# EAGLE design tri to ramp-pls 2-25-23 (EAGLE 9.6.2)
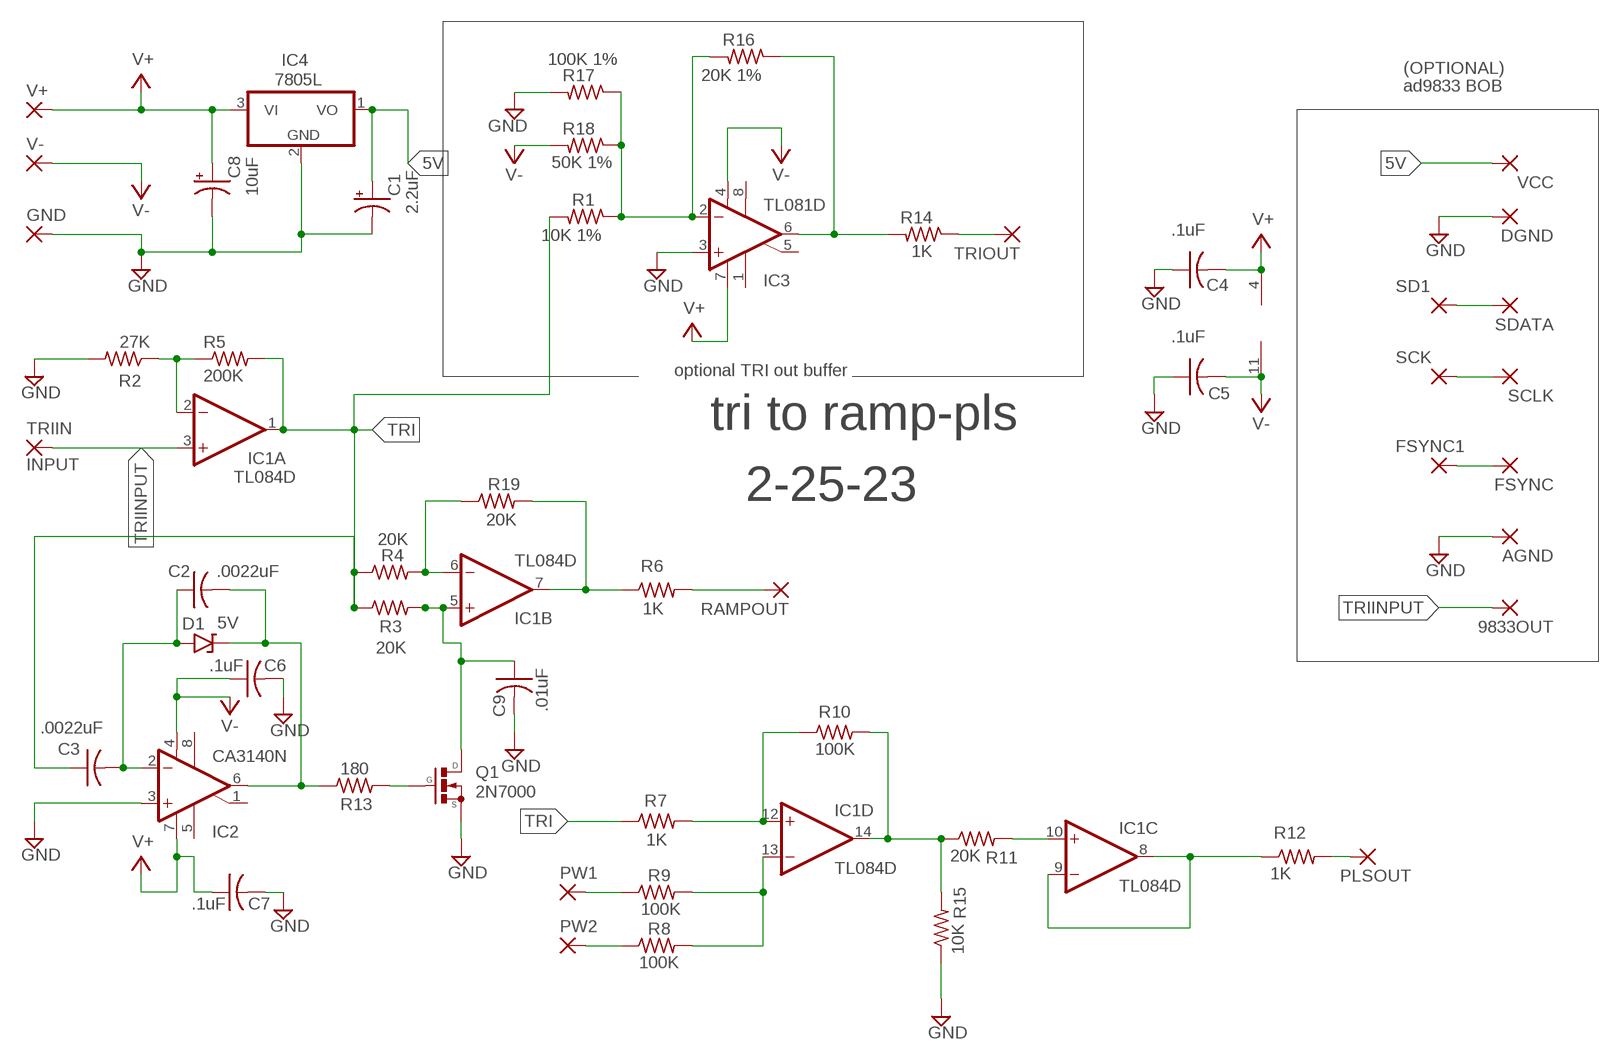
[diagram p0: schematic, sheet 1]

## Parts
9833OUT  WIREPAD1,6/0,8  [1,6/0,8]
AGND  WIREPAD1,6/0,8  [1,6/0,8]
C1  2.2uF  CPOL-USE5-4  [E5-4]
C2  .0022uF  C-US050-030X075  [C050-030X075]
C3  .0022uF  C-US050-035X075  [C050-035X075]
C4  .1uF  C-US025-025X050  [C025-025X050]
C5  .1uF  C-US025-025X050  [C025-025X050]
C6  .1uF  C-US025-025X050  [C025-025X050]
C7  .1uF  C-US025-025X050  [C025-025X050]
C8  10uF  CPOL-USE5-4  [E5-4]
C9  .01uF  C-US050-035X075  [C050-035X075]
D1  5V  ZENER.3  [DO41-3]
DGND  WIREPAD1,6/0,8  [1,6/0,8]
FSYNC  WIREPAD1,6/0,8  [1,6/0,8]
FSYNC1  WIREPAD1,6/0,8  [1,6/0,8]
GND  WIREPAD1,6/0,8  [1,6/0,8]
IC1  TL084D  [SO14]
IC2  CA3140N  [DIL08]
IC3  TL081D  [SO08]
IC4  7805L  ADAFRUIT_7805L  [ADAFRUIT_TO92]
PLSOUT  WIREPAD1,6/0,8  [1,6/0,8]
PW1  WIREPAD1,6/0,8  [1,6/0,8]
PW2  WIREPAD1,6/0,8  [1,6/0,8]
Q1  2N7000  [TO92-]
R1  10K 1%  R-US_0204/7  [0204/7]
R2  27K  R-US_0204/7  [0204/7]
R3  20K  R-US_0204/7  [0204/7]
R4  20K  R-US_0204/7  [0204/7]
R5  200K  R-US_0204/7  [0204/7]
R6  1K  R-US_0204/7  [0204/7]
R7  1K  R-US_0204/7  [0204/7]
R8  100K  R-US_0204/7  [0204/7]
R9  100K  R-US_0204/7  [0204/7]
R10  100K  R-US_0204/7  [0204/7]
R11  20K  R-US_0204/7  [0204/7]
R12  1K  R-US_0204/7  [0204/7]
R13  180  R-US_0204/7  [0204/7]
R14  1K  R-US_0204/7  [0204/7]
R15  10K  R-US_0204/7  [0204/7]
R16  20K 1%  R-US_0204/7  [0204/7]
R17  100K 1%  R-US_0204/7  [0204/7]
R18  50K 1%  R-US_0204/7  [0204/7]
R19  20K  R-US_0204/7  [0204/7]
RAMPOUT  WIREPAD1,6/0,8  [1,6/0,8]
SCK  WIREPAD1,6/0,8  [1,6/0,8]
SCLK  WIREPAD1,6/0,8  [1,6/0,8]
SD1  WIREPAD1,6/0,8  [1,6/0,8]
SDATA  WIREPAD1,6/0,8  [1,6/0,8]
TRIIN  INPUT  WIREPAD1,6/0,8  [1,6/0,8]
TRIOUT  WIREPAD1,6/0,8  [1,6/0,8]
V+  WIREPAD1,6/0,8  [1,6/0,8]
V-  WIREPAD1,6/0,8  [1,6/0,8]
VCC  WIREPAD1,6/0,8  [1,6/0,8]

## Nets
5V: C1.+ IC4.1(VO) VCC.1(P)
GND: AGND.1(P) C1.- C4.1 C5.1 C6.2 C7.2 C8.- C9.2 DGND.1(P) GND.1(P) IC2.3(+IN) IC3.3(+IN) IC4.2(GND) Q1.3(S) R2.2 R15.1 R17.2
N$1: IC1.2(A:-IN) R2.1 R5.1
N$2: PW1.1(P) R9.1
N$3: SD1.1(P) SDATA.1(P)
N$4: IC1.12(D:+IN) R7.2 R10.1
N$5: IC1.6(B:-IN) R4.2 R19.1
N$6: C9.1 IC1.5(B:+IN) Q1.1(D) R3.2
N$7: C2.1 C3.2 D1.A IC2.2(-IN)
N$8: IC1.7(B:OUT) R6.1 R19.2
N$9: C2.2 D1.C IC2.6(OUT) R13.1
N$10: Q1.2(G) R13.2
N$11: IC1.14(D:OUT) R10.2 R11.1 R15.2
N$12: R6.2 RAMPOUT.1(P)
N$13: IC1.10(C:+IN) R11.2
N$14: IC1.8(C:OUT) IC1.9(C:-IN) R12.1
N$15: PLSOUT.1(P) R12.2
N$16: IC1.13(D:-IN) R8.2 R9.2
N$17: IC3.2(-IN) R1.1 R16.2 R17.1 R18.1
N$18: PW2.1(P) R8.1
N$19: R14.1 TRIOUT.1(P)
N$20: SCK.1(P) SCLK.1(P)
N$21: FSYNC1.1(P) FSYNC.1(P)
N$22: IC3.6(OUT) R14.2 R16.1
TRI: C3.1 IC1.1(A:OUT) R1.2 R3.1 R4.1 R5.2 R7.1
TRIINPUT: 9833OUT.1(P) IC1.3(A:+IN) TRIIN.1(P)
V+: C4.2 C7.1 C8.+ IC1.4(P:V+) IC2.7(V+) IC3.7(V+) IC4.3(VI) V+.1(P)
V-: C5.2 C6.1 IC1.11(P:V-) IC2.4(V-) IC3.4(V-) R18.2 V-.1(P)
Unconnected: IC2.1(ON/CMP) IC2.5(ON) IC2.8(CMP) IC3.1(ON1) IC3.5(ON2) IC3.8(OPT)

## Notes on the sheet
- (OPTIONAL)
- ad9833 BOB
- optional TRI out buffer
- tri to ramp-pls
- 2-25-23

## Library data of the parts
9833OUT AGND DGND FSYNC FSYNC1 GND PLSOUT PW1 PW2 RAMPOUT SCK SCLK SD1 SDATA TRIIN TRIOUT V+ V- VCC = wirepad:WIREPAD: Wire PAD connect wire on PCB
C1 C8 = adafruit:CPOL-US: POLARIZED CAPACITOR, American symbol
C2-C7 C9 = rcl:C-US: CAPACITOR, American symbol; SPICEPREFIX: C
D1 = diodes:ZENER
IC1 = linear:TL084: OP AMP
IC2 = linear:CA3140: OP AMP
IC3 = linear:TL081: OP AMP
IC4 = avr328 11-4-21:ADAFRUIT_78*: Positive VOLTAGE REGULATOR Added bigger pads to the TO-92 package
Q1 = transistors:2N7000
R1-R19 = rcl:R-US_: RESISTOR, American symbol

## Board
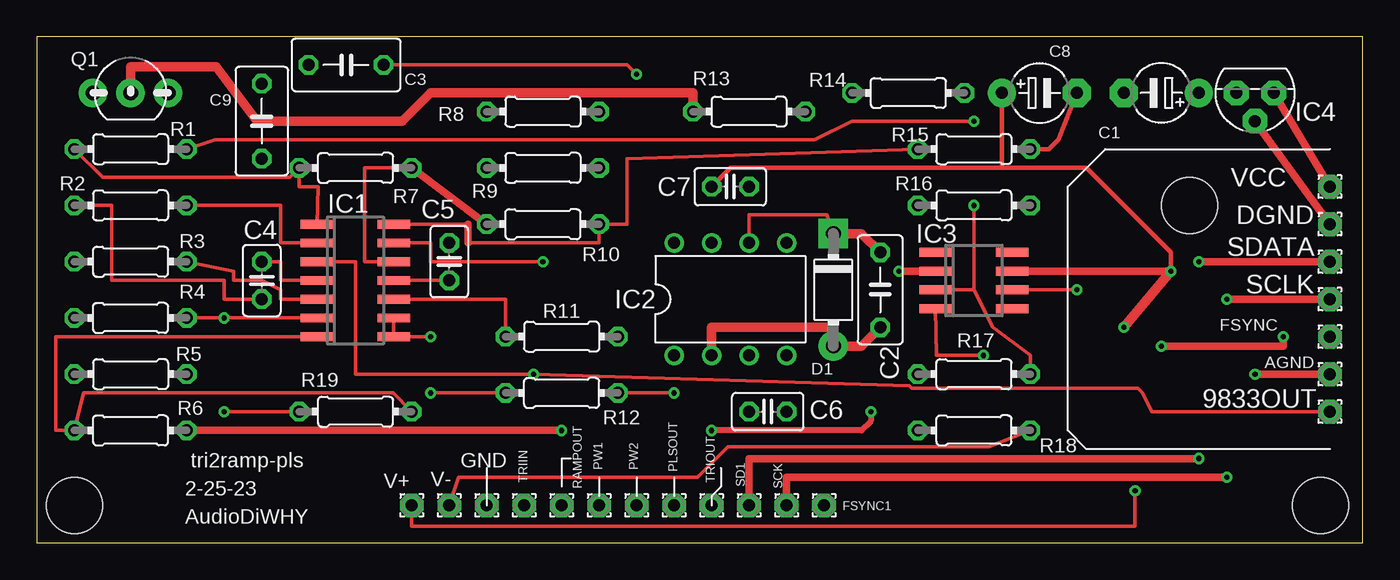
[diagram p1: board, top side]
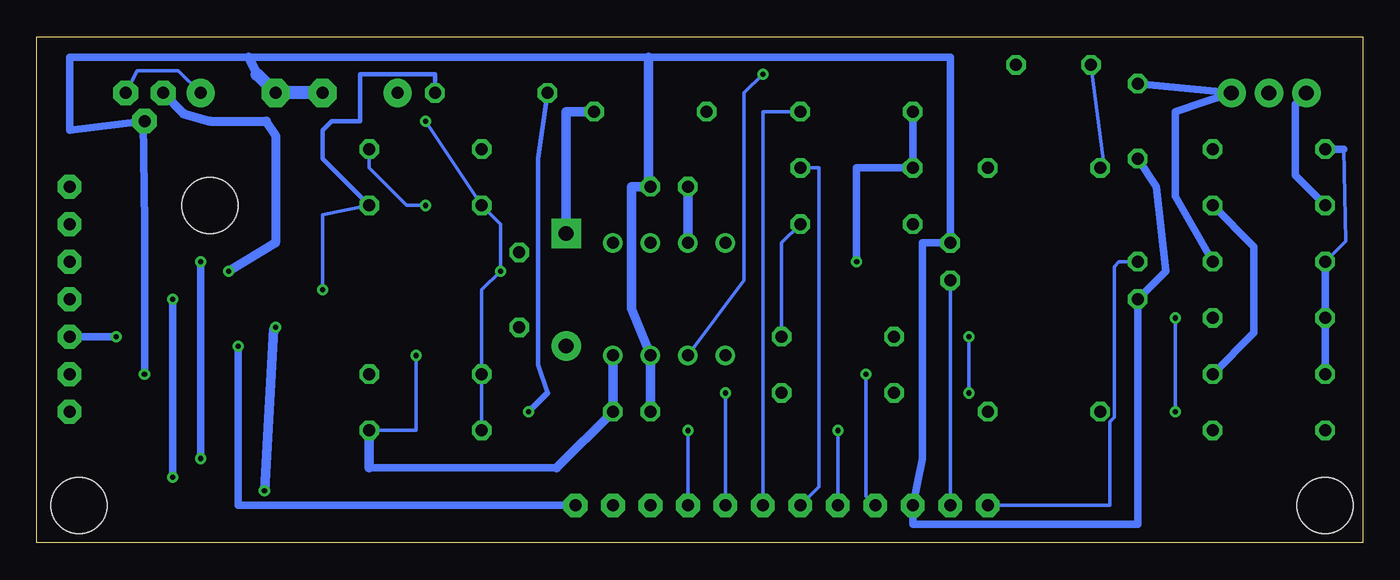
[diagram p2: board, bottom side, seen from below]

Size 89.84 x 34.28 mm. Coordinates in mm from the lower left corner, seen from the top.
Outline: 0,0 89.84,0 89.84,34.28 0,34.28 0,0
Copper layers (1*16): Top 0.035mm / dielectric 1.5mm / Bottom 0.035mm
Design rules "default": minimum track width 6mil, minimum drill 0.35mm, track to track 6mil, track to pad 6mil, pad to pad 6mil, via to via 6mil, smd to smd 6mil, copper to edge 40mil, drill to drill 6mil, minimum pad ring 10mil, minimum via ring 8mil, stop-mask expansion 4mil, vias tented up to drill 0mil, thermal gap 10mil
Holes 3.81 mm at 2.54,2.54 87,2.54 78.11,22.86

### Footprints (pad centres in the part's own frame; a part is rotated, then mirrored left to right if it is on the bottom)
1,6/0,8 = drill 0.813 pad 1.6 octagon: 1 0,0
E5-4 = drill 0.813 pad 1.905: + -2.54,0 | drill 0.813 pad 1.905 octagon: - 2.54,0
C050-030X075 = drill 0.813 octagon: 1 -2.54,0; 2 2.54,0
C050-035X075 = drill 0.813 octagon: 1 -2.54,0; 2 2.54,0
C025-025X050 = drill 0.813 octagon: 1 -1.27,0; 2 1.27,0
DO41-3 = drill 1 pad 2: A 3.81,0 | drill 1 pad 2 square: C -3.81,0
SO14 = smd 0.6 x 2.2: 1 -3.81,-2.6; 2 -2.54,-2.6; 3 -1.27,-2.6; 4 0,-2.6; 5 1.27,-2.6; 6 2.54,-2.6; 7 3.81,-2.6; 8 3.81,2.6; 9 2.54,2.6; 10 1.27,2.6; 11 0,2.6; 12 -1.27,2.6; 13 -2.54,2.6; 14 -3.81,2.6
DIL08 = drill 0.813 pad 1.27: 1 -3.81,-3.81; 2 -1.27,-3.81; 3 1.27,-3.81; 4 3.81,-3.81; 5 3.81,3.81; 6 1.27,3.81; 7 -1.27,3.81; 8 -3.81,3.81
SO08 = smd 0.6 x 2.2: 1 -1.905,-2.6; 2 -0.635,-2.6; 3 0.635,-2.6; 4 1.905,-2.6; 5 1.905,2.6; 6 0.635,2.6; 7 -0.635,2.6; 8 -1.905,2.6
ADAFRUIT_TO92 = drill 0.813 pad 1.676 octagon: 1 -1.27,0; 2 0,1.905; 3 1.27,0
TO92- = drill 1 pad 1.93: 1 2.54,0; 2 0,0; 3 -2.54,0
0204/7 = drill 0.813 octagon: 1 -3.81,0; 2 3.81,0

### Placement (x,y rotation side)
9833OUT  87.63,8.89 0 top
AGND  87.63,11.43 0 top
C1  76.2,30.48 180 top
C2  57.15,17.14 90 top
C3  20.95,32.38 0 top
C4  15.24,17.78 90 top
C5  27.94,19.05 270 top
C6  49.53,8.89 180 top
C7  46.99,24.13 0 top
C8  67.94,30.48 0 top
C9  15.24,28.57 270 top
D1  53.98,17.14 270 top
DGND  87.63,21.59 0 top
FSYNC  87.63,13.97 0 top
FSYNC1  53.34,2.54 0 top
GND  30.48,2.54 0 top
IC1  21.59,17.78 270 top
IC2  46.99,16.51 0 top
IC3  63.5,17.78 270 top
IC4  82.55,30.48 180 top
PLSOUT  43.18,2.54 0 top
PW1  38.1,2.54 0 top
PW2  40.64,2.54 0 top
Q1  6.35,30.48 0 top
R1  6.35,26.67 180 top
R2  6.35,22.86 180 top
R3  6.35,19.05 0 top
R4  6.35,15.24 0 top
R5  6.35,11.43 180 top
R6  6.35,7.62 0 top
R7  21.59,25.4 0 top
R8  34.29,29.21 180 top
R9  34.29,25.4 180 top
R10  34.29,21.59 0 top
R11  35.56,13.97 180 top
R12  35.56,10.16 0 top
R13  48.26,29.21 180 top
R14  59.05,30.48 0 top
R15  63.5,26.67 180 top
R16  63.5,22.86 180 top
R17  63.5,11.43 0 top
R18  63.5,7.62 0 top
R19  21.59,8.89 0 top
RAMPOUT  35.56,2.54 0 top
SCK  50.8,2.54 0 top
SCLK  87.63,16.51 0 top
SD1  48.26,2.54 0 top
SDATA  87.63,19.05 0 top
TRIIN  33.02,2.54 0 top
TRIOUT  45.72,2.54 0 top
V+  25.4,2.54 0 top
V-  27.94,2.54 0 top
VCC  87.63,24.13 0 top

### Tracks (layer width: path | path; a pad name or v marks a point on that pad's centre or on a via)
5V
  Top 0.508: VCC.1 IC4.1
  Bottom 0.254: C1.+ 80.26,32 83.06,32 IC4.1
GND  (via drill 0.35)
  Top 0.254: C4.1 12.7,16.51 12.7,17.78 5.08,17.78 5.08,22.86 R2.2 | IC3.3 63.5,17.14 | 63.5,17.14 64.77,14.61 67.31,12.7 R17.2 | 63.5,17.14 v63.5,22.86
  Top 0.305: R15.1 68.58,26.67 69.22,27.3 C8.-
  Top 0.508: DGND.1 IC4.2 | v82.55,11.43 AGND.1
  Bottom 0.254: 82.63,28.57 IC4.2 | v63.5,22.86 64.77,22.86 67.31,25.4 R15.1
  Bottom 0.508: R2.2 4.57,24.89 4.57,29.72 Q1.3 | v82.55,11.43 82.55,21.59 82.63,28.57 87.63,27.94 87.63,32.89 75.5,32.89 48.39,32.89 27.94,32.89 C5.1 29.84,20.32 29.84,5.71 GND.1 30.48,1.27 15.24,1.27 C4.1 13.34,18.41 13.97,24.13 C9.2 | C7.2 48.39,24.26
  Bottom 0.635: 75.5,32.89 74.93,31.75 | 48.39,32.89 48.39,24.26 | C6.2 IC2.3 49.53,15.88 49.53,24.13 C7.2
  Bottom 0.889: 74.93,31.75 C1.- C8.-
N$1
  Top 0.254: IC1.2 16.51,20.32 16.51,22.86 R2.1
  Bottom 0.508: R2.1 7.37,20.07 7.37,14.22 R5.1
N$2
  Bottom 0.254: PW1.1 36.83,3.81 36.83,25.4 R9.1
N$3  (via drill 0.35)
  Top 0.508: SDATA.1 v78.74,19.05 | v78.74,5.71 48.26,5.71 SD1.1
  Bottom 0.508: v78.74,19.05 v78.74,5.71
N$4
  Top 0.254: IC1.12 22.23,19.05 22.23,25.4 R7.2
  Top 0.508: R10.1 R7.2
N$5  (via drill 0.35)
  Top 0.254: v12.7,8.89 R19.1 | IC1.6 v12.7,15.24 R4.2
  Bottom 0.254: v12.7,15.24 v12.7,8.89
N$6
  Top 0.254: IC1.5 16.51,16.51 16.51,17.14 15.24,17.78 13.34,17.78 13.34,18.41 R3.2
  Bottom 0.508: R3.2 12.7,23.5 12.7,29.21 Q1.1 C9.1
N$7  (via drill 0.35)
  Top 0.254: C3.2 40.01,32.38 v40.64,31.75
  Top 0.635: IC2.2 45.72,14.61 53.98,14.61 D1.A 55.88,13.34 C2.1
  Bottom 0.254: IC2.2 41.91,17.78 41.91,30.48 v40.64,31.75
N$8
  Top 0.254: IC1.7 1.27,13.97 1.27,7.62 R6.1 3.17,10.16 24.13,10.16 R19.2
N$9
  Top 0.254: D1.C 53.55,22.23 48.26,22.23 IC2.6
  Top 0.635: D1.C 55.88,20.95 C2.2
  Bottom 0.635: D1.C 53.98,29.21 R13.1
N$10
  Top 0.635: Q1.2 6.35,32.26 12.16,32.26 14.92,28.57 24.77,28.57 26.67,30.48 44.45,30.48 R13.2
N$11
  Top 0.254: R15.2 40.01,26.04 40.01,21.59 R10.2 38.1,20.32 29.21,20.32 | IC1.14 29.21,21.59
  Top 0.508: 29.21,21.59 29.21,20.32
  Bottom 0.254: R10.2 39.37,20.32 R11.1
N$12  (via drill 0.35)
  Top 0.508: v35.56,7.62 R6.2
  Bottom 0.254: RAMPOUT.1 v35.56,7.62
N$13
  Top 0.254: IC1.10 31.75,16.51 R11.2
N$14  (via drill 0.35)
  Top 0.254: v26.67,13.97 IC1.8 IC1.9 | v26.67,10.16 R12.1
  Bottom 0.254: v26.67,13.97 v26.67,10.16
N$15  (via drill 0.35)
  Top 0.254: v43.18,10.16 R12.2
  Bottom 0.254: PLSOUT.1 v43.18,10.16
N$16  (via drill 0.35)
  Top 0.254: IC1.13 26.67,20.32 26.67,19.05 v34.29,19.05
  Bottom 0.508: R8.2 R9.2 34.29,25.4 v34.29,19.05
N$17  (via drill 0.35)
  Top 0.254: v63.5,28.57 55.24,28.57 52.7,27.3 12.06,27.3 R1.1
  Top 0.508: v58.42,18.41 IC3.2
  Bottom 0.254: R18.1 R17.1 59.69,17.14 v58.42,18.41 58.42,21.59 R16.2 v63.5,28.57
N$18
  Bottom 0.254: PW2.1 40.64,29.21 R8.1
N$19  (via drill 0.35)
  Top 0.406: v56.52,8.89 56.52,8.26 55.88,7.62 v45.72,7.62
  Bottom 0.254: TRIOUT.1 v45.72,7.62
  Bottom 0.305: 55.24,10.16 55.88,12.06 55.88,26.04 R14.1
  Bottom 0.406: v56.52,8.89 55.24,10.16
N$20  (via drill 0.35)
  Top 0.508: SCLK.1 v80.64,16.51 | v80.64,4.45 50.8,4.45 SCK.1
  Bottom 0.508: v80.64,16.51 v80.64,4.45
N$21  (via drill 0.35)
  Top 0.508: v84.45,13.97 84.45,13.34 v76.2,13.34
  Bottom 0.508: FSYNC.1 v84.45,13.97 | v76.2,13.34 76.2,2.54 FSYNC1.1
N$22  (via drill 0.35)
  Top 0.254: IC3.6 v70.48,17.14
  Bottom 0.254: v70.48,17.14 70.48,22.23 R16.1
  Bottom 0.305: R16.1 70.48,26.04 70.48,27.94 69.85,28.57 67.94,28.57 67.94,31.75 62.87,31.75 R14.2
TRI
  Top 0.254: IC1.1 19.05,24.13 17.78,24.13 R7.1 17.14,24.77 4.45,24.77 R1.2
  Bottom 0.254: R3.1 1.14,20.45 1.27,26.67 | R7.1 17.52,25.66 C3.1
  Bottom 0.508: R5.2 2.33,11.64 2.54,12.06 R4.1 R3.1 | 1.27,26.67 R1.2
TRIINPUT  (via drill 0.35)
  Top 0.254: IC1.3 21.59,19.05 21.59,11.43 v33.66,11.43 59.15,10.65 59.3,10.49 74.6,10.49 74.93,10.16 75.56,8.89 9833OUT.1
  Bottom 0.254: v33.66,11.43 33.66,3.17 TRIIN.1
V+  (via drill 0.35)
  Top 0.254: IC1.4 16.51,17.78 16.51,19.05 C4.2 | v74.42,3.53 74.42,1.14 25.4,1.14 V+.1
  Top 0.305: C7.1 46.99,25.4 65.41,25.4 | v76.83,18.41 76.83,19.68 71.12,25.4 65.41,25.4 | C8.+ 65.41,25.4
  Top 0.508: IC3.7 v76.83,18.41
  Top 0.635: v76.83,18.41 v73.66,14.61
  Bottom 0.254: C4.2 16.51,19.05 16.84,18.72 16.84,8.5 17.14,8.2 17.14,2.54 V+.1
  Bottom 0.61: v76.83,18.41 73.66,20.32 73.66,27.6 74.3,28.57 78.11,28.57 79.88,29.08
  Bottom 0.635: IC4.3 79.88,29.08 | v74.42,3.53 73.78,14.49 v73.66,14.61 | IC2.7 C7.1
V-  (via drill 0.35)
  Top 0.254: IC1.11 C5.2 | IC3.4 60.96,12.7 v64.14,12.7 | R18.2 64.52,6.5 46.82,6.5 44.76,4.45 28.57,4.45 V-.1
  Bottom 0.254: C5.2 V-.1 | v64.14,12.7 64.14,7.62 R18.2
  Bottom 0.508: 54.61,5.08 67.31,5.08
  Bottom 0.635: IC2.4 C6.1 54.61,5.08 | 67.31,5.08 R18.2

### Text on the board
tNames: tri2ramp-pls | 2-25-23 | AudioDiWHY